# EAGLE schematic ICS-RS232C Converter (EAGLE 6.5.0)
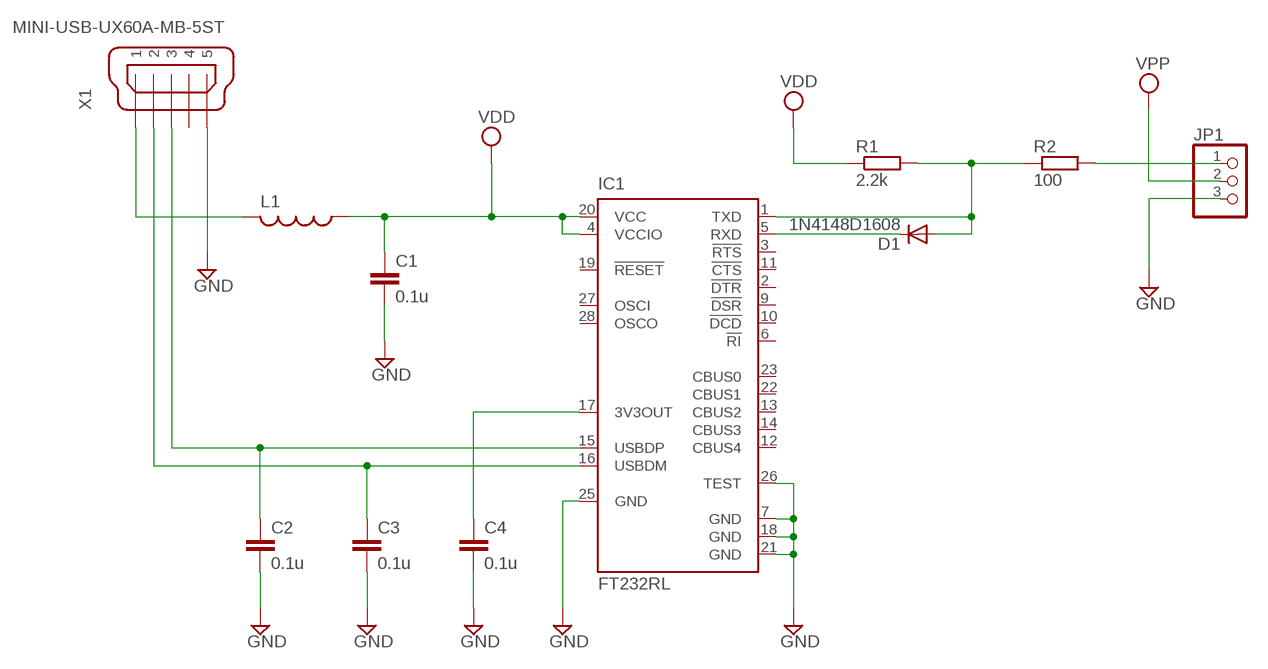
[diagram p0: schematic, sheet 1]

## Parts
C1  0.1u  C-EUC1608  [C1608]
C2  0.1u  C-EUC1608  [C1608]
C3  0.1u  C-EUC1608  [C1608]
C4  0.1u  C-EUC1608  [C1608]
D1  1N4148D1608  [D1608]
IC1  FT232RL  [SSOP28]
JP1  PINHD-1X3  [1X03]
L1  L-USL2012C  [L2012C]
R1  2.2k  R-EU_R1608  [C1608]
R2  100  R-EU_R1608  [C1608]
X1  MINI-USB-UX60A-MB-5ST  [UX60A-MB-5ST]

## Nets
GND: C1.2 C2.2 C3.2 C4.2 IC1.7(GND) IC1.18(GND) IC1.21(GND) IC1.25(GND) IC1.26(TEST) JP1.3 X1.5
N$1: L1.2 X1.1
N$2: C3.1 IC1.16(USBDM) X1.2
N$3: C2.1 IC1.15(USBDP) X1.3
N$4: C4.1 IC1.17(3V3OUT)
N$5: D1.2(C) IC1.5(RXD)
N$6: D1.1(A) IC1.1(TXD) R1.2 R2.1
N$8: JP1.1 R2.2
VDD: C1.1 IC1.4(VCCIO) IC1.20(VCC) L1.1 R1.1
VPP: JP1.2
Unconnected: IC1.2(!DTR) IC1.3(!RTS) IC1.6(!RI) IC1.9(!DSR) IC1.10(!DCD) IC1.11(!CTS) IC1.12(CBUS4) IC1.13(CBUS2) IC1.14(CBUS3) IC1.19(!RESET) IC1.22(CBUS1) IC1.23(CBUS0) IC1.27(OSCI) IC1.28(OSCO) X1.4

## Library data of the parts
C1-C4 = rcl:C-EU: CAPACITOR, European symbol
D1 = diode:1N4148: DIODE high speed (Philips)
IC1 = ftdichip:FT232R: Source: http://www.ftdichip.com/Documents/DataSheets/DS_FT232R_v104.pdf; MPN: FT232RL; OC_FARNELL: 1146032; OC_NEWARK: 91K9918
JP1 = pinhead:PINHD-1X3: PIN HEADER
L1 = rcl:L-US: INDUCTOR, American symbol
R1 R2 = rcl:R-EU_: RESISTOR, European symbol
X1 = con-hirose:MINI-USB-: MINI USB Connector Source: http://www.hirose.co.jp/cataloge_hp/e24000019.pdf; OC_FARNELL: unknown; OC_NEWARK: unknown